# EAGLE design TiltMouseSurfaceMount (EAGLE 8.0.0)
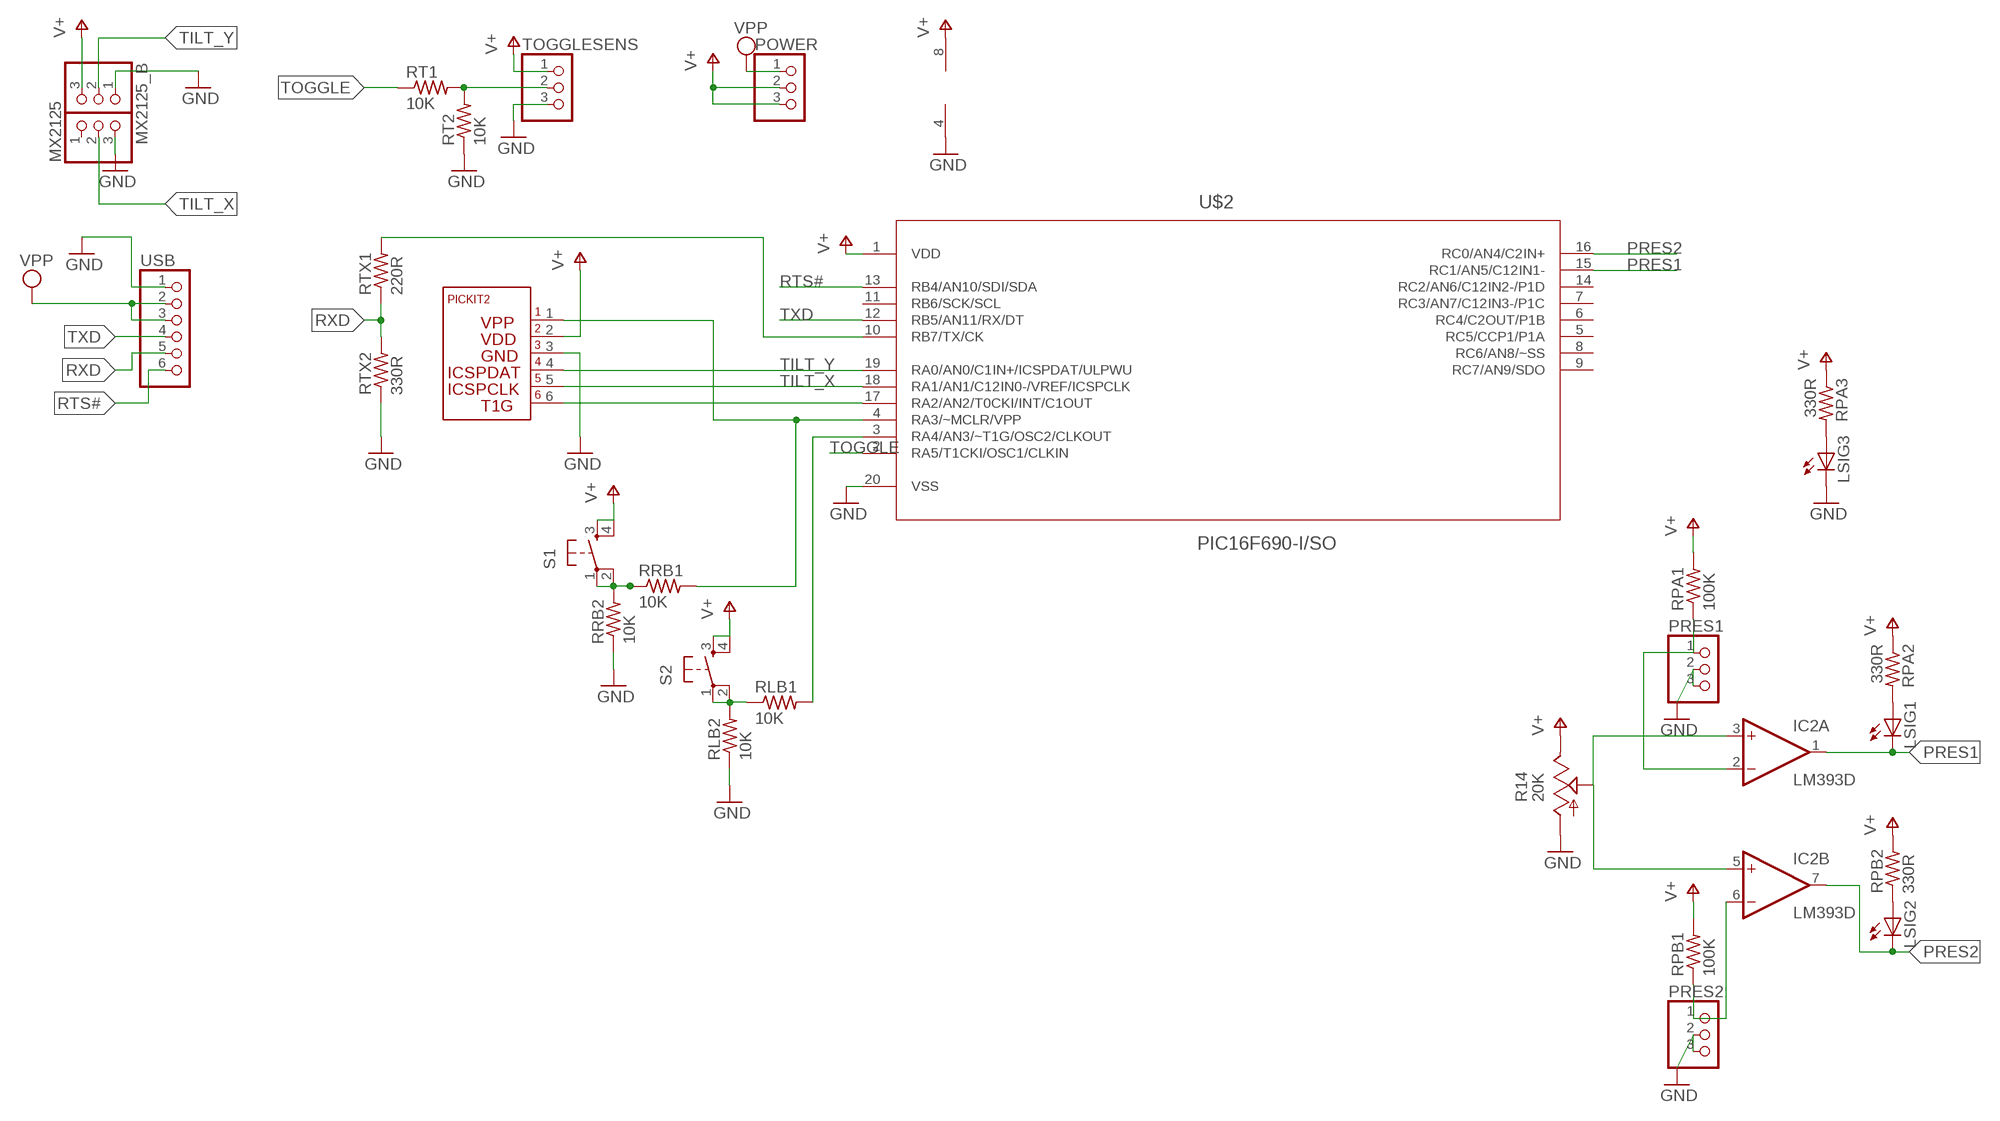
[diagram p0: schematic, sheet 1]

## Parts
IC2  LM393D  [SO08]
LSIG1  LEDSMT1206  [1206]
LSIG2  LEDSMT1206  [1206]
LSIG3  LEDSMT1206  [1206]
MX2125  PINHD-1X3  [1X03]
MX2125_B  PINHD-1X3  [1X03]
POWER  PINHD-1X3  [1X03]
PRES1  PINHD-1X3/90  [1X03/90]
PRES2  PINHD-1X3/90  [1X03/90]
R14  20K  TRIM_US-SM-42/43A  [SM-42/43A]
RLB1  10K  R-US_R0805  [R0805]
RLB2  10K  R-US_R0805  [R0805]
RPA1  100K  R-US_R0805  [R0805]
RPA2  330R  R-US_R0805  [R0805]
RPA3  330R  R-US_R0805  [R0805]
RPB1  100K  R-US_R0805  [R0805]
RPB2  330R  R-US_R0805  [R0805]
RRB1  10K  R-US_R0805  [R0805]
RRB2  10K  R-US_R0805  [R0805]
RT1  10K  R-US_R0805  [R0805]
RT2  10K  R-US_R0805  [R0805]
RTX1  220R  R-US_R0805  [R0805]
RTX2  330R  R-US_R0805  [R0805]
S1  TAC_SWITCHSMD  [TACTILE_SWITCH_SMD]
S2  TAC_SWITCHSMD  [TACTILE_SWITCH_SMD]
TOGGLESENS  PINHD-1X3  [1X03]
U$2  PIC16F690-I/SO  [SOIC127P1030X265-20N]
U$3  PICKIT-ICSP  [PICKITJUMPER]
USB  PINHD-1X6/90  [1X06/90]

## Nets
GND: IC2.4(P:V-) LSIG3.C MX2125.3 MX2125_B.1 PRES1.2 PRES1.3 PRES2.2 PRES2.3 R14.1(A) RLB2.1 RRB2.1 RT2.1 RTX2.1 TOGGLESENS.3 U$2.20(VSS) U$3.3 USB.1
N$2: RT1.2 RT2.2 TOGGLESENS.2
N$3: IC2.2(A:-IN) PRES1.1 RPA1.1
N$5: RTX1.2 U$2.10(RB7/TX/CK)
N$6: RRB1.1 RRB2.2 S1.1 S1.2
N$7: RLB1.1 RLB2.2 S2.1 S2.2
N$8: RLB1.2 U$2.3(RA4/AN3/~T1G/OSC2/CLKOUT)
N$9: IC2.6(B:-IN) PRES2.1 RPB1.1
N$10: IC2.3(A:+IN) IC2.5(B:+IN) R14.2(S)
N$11: LSIG2.A RPB2.1
N$12: LSIG1.A RPA2.2
N$13: LSIG3.A RPA3.2
N$14: RRB1.2 U$2.4(RA3/~MCLR/VPP) U$3.1
N$15: U$2.17(RA2/AN2/T0CKI/INT/C1OUT) U$3.6
PRES1: IC2.1(A:OUT) LSIG1.C U$2.15(RC1/AN5/C12IN1-)
PRES2: IC2.7(B:OUT) LSIG2.C U$2.16(RC0/AN4/C2IN+)
RTS#: U$2.13(RB4/AN10/SDI/SDA) USB.6
RXD: RTX1.1 RTX2.2 USB.5
TILT_X: MX2125.2 U$2.18(RA1/AN1/C12IN0-/VREF/ICSPCLK) U$3.5
TILT_Y: MX2125_B.2 U$2.19(RA0/AN0/C1IN+/ICSPDAT/ULPWU) U$3.4
TOGGLE: RT1.1 U$2.2(RA5/T1CKI/OSC1/CLKIN)
TXD: U$2.12(RB5/AN11/RX/DT) USB.4
V+: IC2.8(P:V+) MX2125_B.3 POWER.2 POWER.3 R14.3(E) RPA1.2 RPA2.1 RPA3.1 RPB1.2 RPB2.2 S1.3 S1.4 S2.3 S2.4 TOGGLESENS.1 U$2.1(VDD) U$3.2
VPP: POWER.1 USB.2 USB.3
Unconnected: MX2125.1 U$2.5(RC5/CCP1/P1A) U$2.6(RC4/C2OUT/P1B) U$2.7(RC3/AN7/C12IN3-/P1C) U$2.8(RC6/AN8/~SS) U$2.9(RC7/AN9/SDO) U$2.11(RB6/SCK/SCL) U$2.14(RC2/AN6/C12IN2-/P1D)

## Library data of the parts
IC2 = linear:LM393: COMPARATOR
LSIG1-LSIG3 = led:LED: LED OSRAM: - CHIPLED LG R971, LG N971, LY N971, LG Q971, LY Q971, LO R971, LY R971 LH N974, LH R974 LS Q976, LO Q976, LY Q976 LO Q996 - Hyper CHIPLED LW Q18S LB Q993, LB Q99A, LB R99A - SideLED LS A670, LO A670, LY A670, LG A670, LP A670 LB A673, LV A673, LT A673, LW A673 LH A674 LY A675 LS A676, LA A676, LO A676, LY A676, LW A676 LS A679, LY A679, LG A679 - Hyper Micro SIDELED® LS Y876, LA Y876, LO Y876, LY Y876 LT Y87S - SmartLED LW L88C, LW L88S LB L89C, LB L89S, LG L890 LS L89K, LO L89K, LY L89K LS L896, LA L896, LO L896, LY L896 - TOPLED LS T670, LO T670, LY T670, LG T670, LP T670 LSG T670, LSP T670, LSY T670, LOP T670, LYG T670 LG T671, LOG T671, LSG T671 LB T673, LV T673, LT T673, LW T673 LH T674 LS T676, LA T676, LO T676, LY T676, LB T676, LH T676, LSB T676, LW T676 LB T67C, LV T67C, LT T67C, LS T67K, LO T67K, LY T67K, LW E67C LS E67B, LA E67B, LO E67B, LY E67B, LB E67C, LV E67C, LT E67C LW T67C LS T679, LY T679, LG T679 LS T770, LO T770, LY T770, LG T770, LP T770 LB T773, LV T773, LT T773, LW T773 LH T774 LS E675, LA E675, LY E675, LS T675 LS T776, LA T776, LO T776, LY T776, LB T776 LHGB T686 LT T68C, LB T68C - Hyper Mini TOPLED® LB M676 - Mini TOPLED Santana® LG M470 LS M47K, LO M47K, LY M47K Source: http://www.osram.convergy.de LUXEON: - LUMILED® LXK2-PW12-R00, LXK2-PW12-S00, LXK2-PW14-U00, LXK2-PW14-V00 LXK2-PM12-R00, LXK2-PM12-S00, LXK2-PM14-U00 LXK2-PE12-Q00, LXK2-PE12-R00, LXK2-PE12-S00, LXK2-PE14-T00, LXK2-PE14-U00 LXK2-PB12-K00, LXK2-PB12-L00, LXK2-PB12-M00, LXK2-PB14-N00, LXK2-PB14-P00, LXK2-PB14-Q00 LXK2-PR12-L00, LXK2-PR12-M00, LXK2-PR14-Q00, LXK2-PR14-R00 LXK2-PD12-Q00, LXK2-PD12-R00, LXK2-PD12-S00 LXK2-PH12-R00, LXK2-PH12-S00 LXK2-PL12-P00, LXK2-PL12-Q00, LXK2-PL12-R00 Source: www.luxeon.com KINGBRIGHT: KA-3528ASYC Source: www.kingbright.com
MX2125 MX2125_B POWER PRES1 PRES2 TOGGLESENS = pinhead:PINHD-1X3: PIN HEADER
R14 = pot:TRIM_US-: POTENTIOMETER
RLB1 RLB2 RPA1-RPA3 RPB1 RPB2 RRB1 RRB2 RT1 RT2 RTX1 RTX2 = resistor:R-US_: RESISTOR, American symbol
S1 S2 = SparkFun:TAC_SWITCH: Momentary Switch Button commonly used for reset or general input. Spark Fun Electronics SKU : COM-00097
U$2 = Microchip_By_element14_Batch_1:PIC16F690-I/SO: 8-bit CMOS Microcontroller; DESCRIPTION: 8-bit CMOS Microcontroller; MPN: PIC16F690-I/SO; OC_FARNELL: 1292261; OC_NEWARK: 56J7549; PACKAGE: SOIC-18; SUPPLIER: Microchip Technology
U$3 = TEJ4M1:PICKIT-ICSP: The Jumper for connecting in a PICKIT 2
USB = pinhead:PINHD-1X6: PIN HEADER

## Board
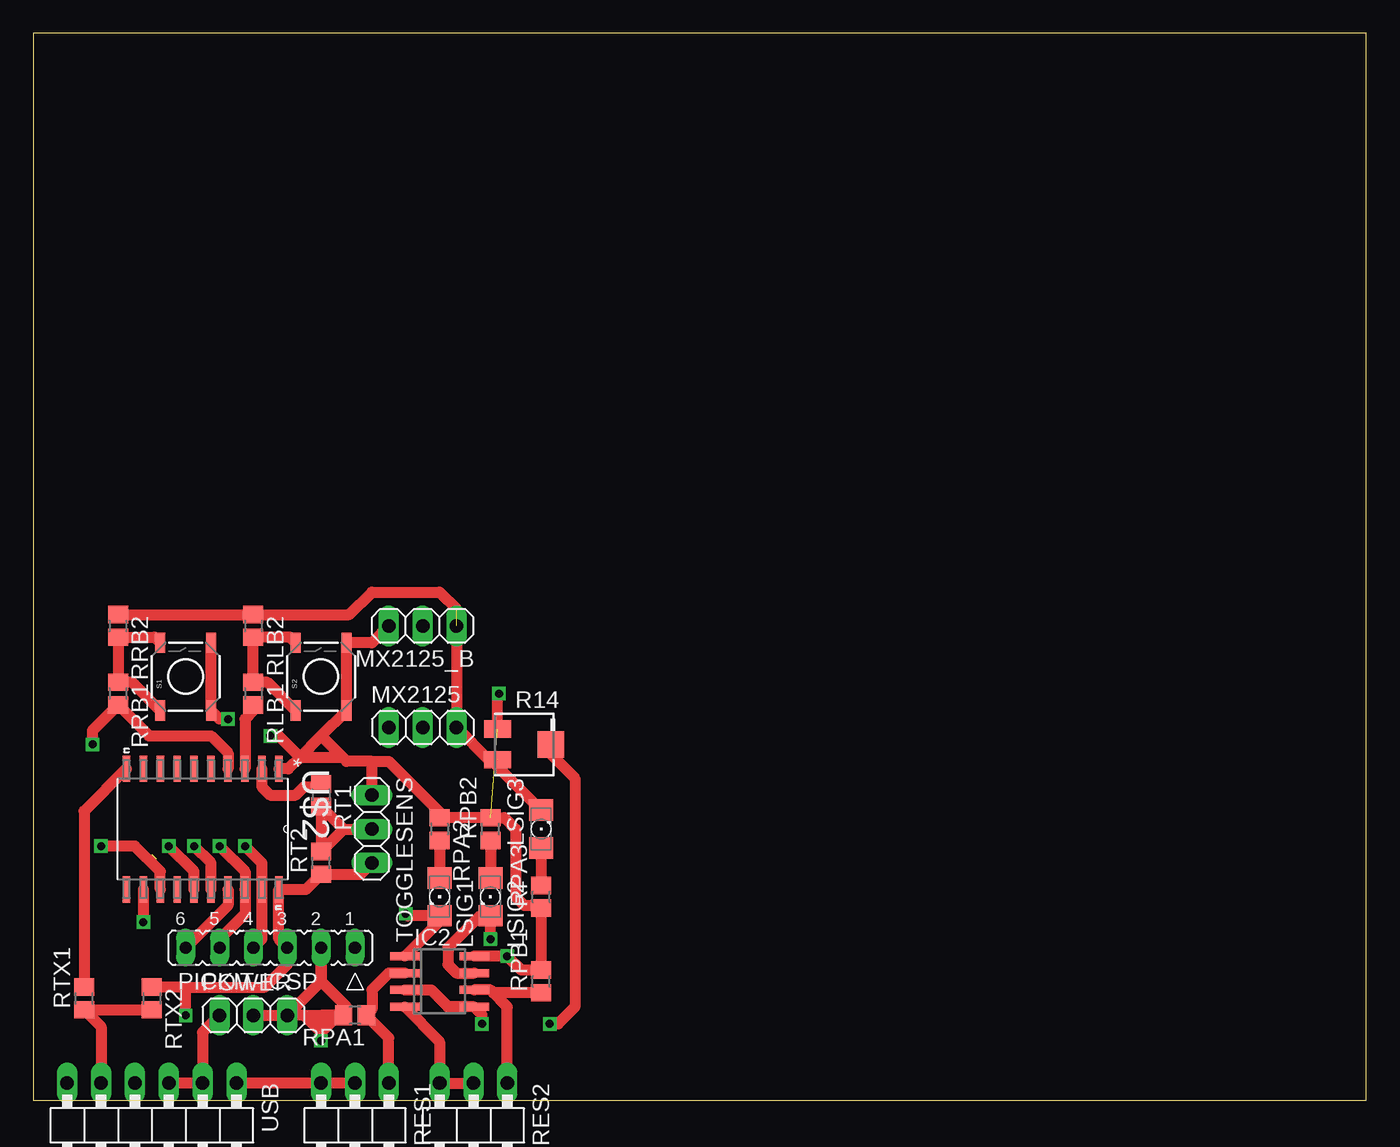
[diagram p1: board, top side]
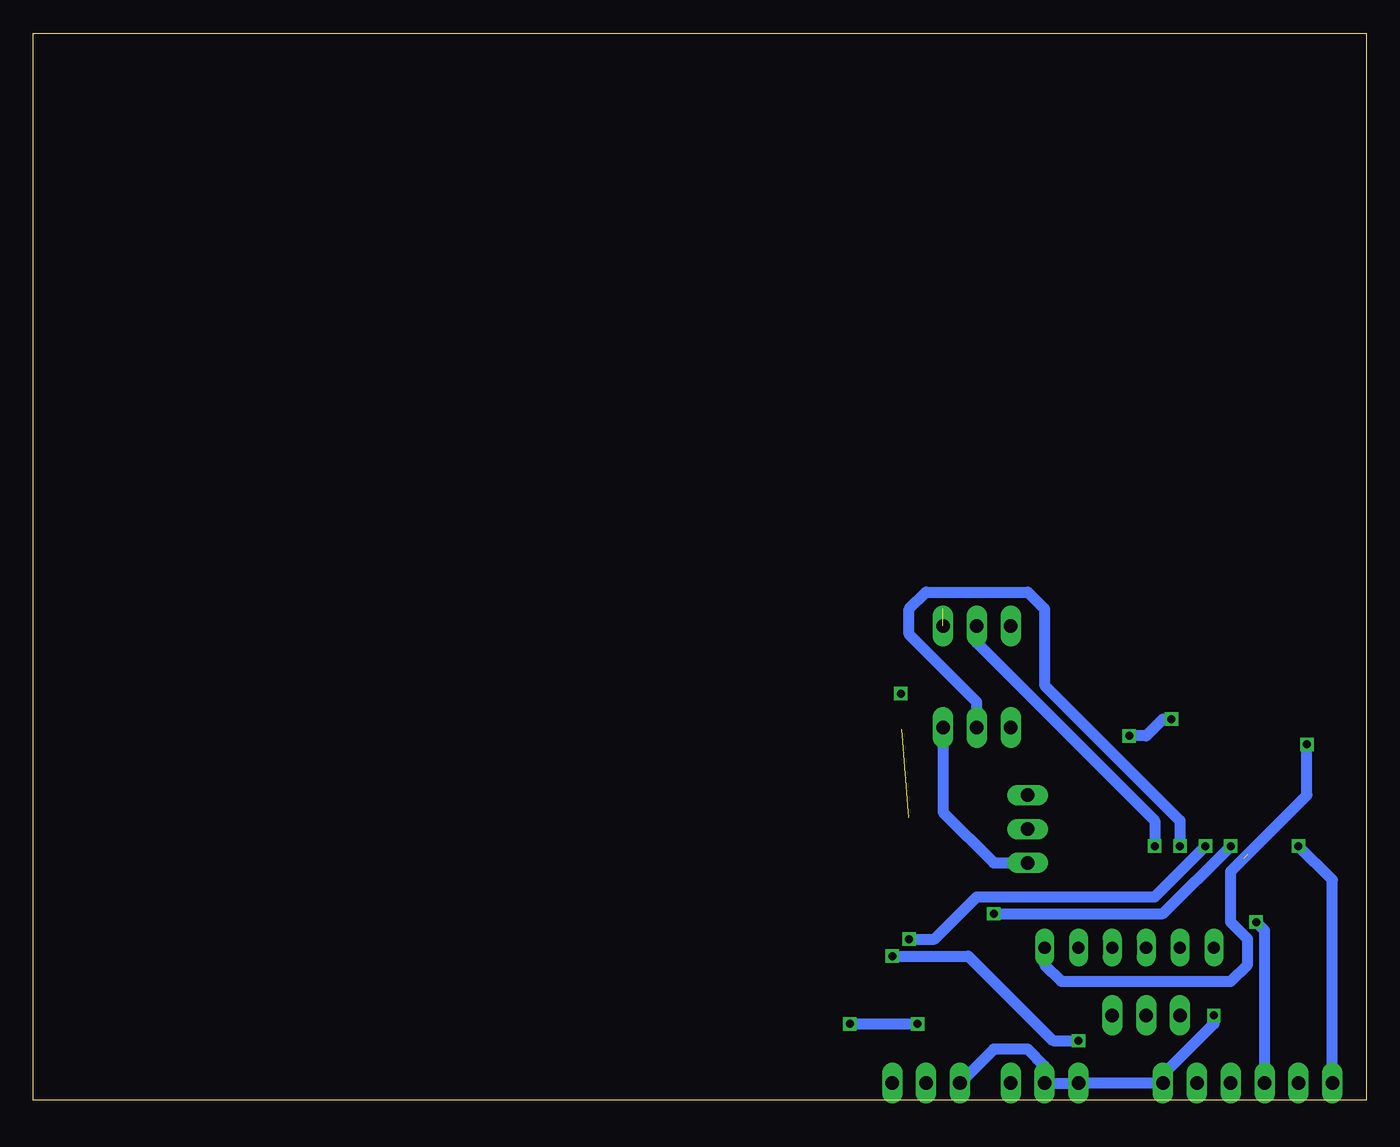
[diagram p2: board, bottom side, seen from below]

Size 100 x 80 mm. Coordinates in mm from the lower left corner, seen from the top.
Outline: 0,0 100,0 100,80 0,80 0,0
Copper layers (1*16): Top 0.035mm / dielectric 1.5mm / Bottom 0.035mm
Design rules "default": minimum track width 10mil, minimum drill 24mil, track to track 8mil, track to pad 8mil, pad to pad 8mil, via to via 8mil, smd to smd 8mil, copper to edge 40mil, drill to drill 8mil, minimum pad ring 10mil, minimum via ring 8mil, stop-mask expansion 4mil, vias tented up to drill 0mil, thermal gap 10mil

### Footprints (pad centres in the part's own frame; a part is rotated, then mirrored left to right if it is on the bottom)
SO08 = smd 0.6 x 2.2: 1 -1.905,-2.6; 2 -0.635,-2.6; 3 0.635,-2.6; 4 1.905,-2.6; 5 1.905,2.6; 6 0.635,2.6; 7 -0.635,2.6; 8 -1.905,2.6
1206 = smd 1.6 x 1.803: A -1.422,0; C 1.422,0
1X03 = drill 1.016 long: 1 -2.54,0; 2 0,0; 3 2.54,0
1X03/90 = drill 1.016 long: 1 -2.54,-3.81; 2 0,-3.81; 3 2.54,-3.81
SM-42/43A = smd 2 x 1.3: 1 2,1.15; 3 2,-1.15 | smd 2 x 2: 2 -2,0
R0805 = smd 1.3 x 1.5: 1 -0.85,0; 2 0.85,0
TACTILE_SWITCH_SMD = smd 1.524 x 0.762: 1 -2.54,1.905; 2 2.54,1.905; 3 -2.54,-1.905; 4 2.54,-1.905
SOIC127P1030X265-20N = smd 1.981 x 0.559: 1 -4.521,5.715; 2 -4.521,4.445; 3 -4.521,3.175; 4 -4.521,1.905; 5 -4.521,0.635; 6 -4.521,-0.635; 7 -4.521,-1.905; 8 -4.521,-3.175; 9 -4.521,-4.445; 10 -4.521,-5.715; 11 4.521,-5.715; 12 4.521,-4.445; 13 4.521,-3.175; 14 4.521,-1.905; 15 4.521,-0.635; 16 4.521,0.635; 17 4.521,1.905; 18 4.521,3.175; 19 4.521,4.445; 20 4.521,5.715
PICKITJUMPER = drill 0.914 long: 1 6.35,3.81; 2 3.81,3.81; 3 1.27,3.81; 4 -1.27,3.81; 5 -3.81,3.81; 6 -6.35,3.81
1X06/90 = drill 1.016 long: 1 -6.35,-3.81; 2 -3.81,-3.81; 3 -1.27,-3.81; 4 1.27,-3.81; 5 3.81,-3.81; 6 6.35,-3.81

### Placement (x,y rotation side)
IC2  30.48,8.89 270 top
LSIG1  30.48,15.24 270 top
LSIG2  34.29,15.24 270 top
LSIG3  38.1,20.32 90 top
MX2125  29.21,27.94 0 top
MX2125_B  29.21,35.56 180 top
POWER  16.51,6.35 0 top
PRES1  24.13,-2.54 180 top
PRES2  33.02,-2.54 180 top
R14  36.83,26.67 180 top
RLB1  16.51,30.48 270 top
RLB2  16.51,35.56 270 top
RPA1  24.13,6.35 180 top
RPA2  30.48,20.32 270 top
RPA3  38.1,15.24 90 top
RPB1  38.1,8.89 90 top
RPB2  34.29,20.32 90 top
RRB1  6.35,30.48 270 top
RRB2  6.35,35.56 270 top
RT1  21.59,22.86 270 top
RT2  21.59,17.78 90 top
RTX1  3.81,7.62 90 top
RTX2  8.89,7.62 270 top
S1  11.43,31.75 90 top
S2  21.59,31.75 90 top
TOGGLESENS  25.4,20.32 270 top
U$2  12.7,20.32 270 top
U$3  17.78,7.62 0 top
USB  8.89,-2.54 180 top

### Tracks (layer width: path | path; a pad name or v marks a point on that pad's centre or on a via)
GND  (via drill 0.6)  (2 unrouted)
  Top 0.813: RRB2.1 RLB2.1 23.71,36.41 25.4,38.1 30.48,38.1 31.75,36.83 | 11.43,8.47 17.36,8.47 19.05,10.16 U$3.3 18.41,12.06 U$2.20 20.46,15.8 21.38,16.72 | 11.43,8.47 RTX2.1 | v11.43,6.35 11.43,8.47 | PRES1.2 PRES1.3 USB.1 | IC2.4 30.48,4.38 PRES2.3 PRES2.2 | 21.38,16.72 RT2.1 | RT2.1 24.55,16.93 TOGGLESENS.3 | RT2.1 21.38,16.72 | RT2.1 21.38,16.72 | RT2.1 21.38,16.72 | LSIG3.C 34.83,25.01 R14.1 34.17,25.52 MX2125.3 MX2125_B.1
  Bottom 0.813: v11.43,6.35 11.43,5.71 15.24,1.91 USB.1 PRES1.3 PRES1.2 24.13,2.54 25.4,3.81 27.94,3.81 PRES2.3 | MX2125.3 31.75,21.59 27.94,17.78 TOGGLESENS.3
N$2
  Top 0.813: 23.28,20.32 TOGGLESENS.2 | 23.28,20.32 RT1.2 RT2.2 23.28,20.32
N$3
  Top 0.813: PRES1.1 26.67,4.66 RPA1.1 25.4,6.77 25.4,8.26 26.67,9.53 IC2.2
N$5
  Top 0.813: U$2.10 3.81,21.67 RTX1.2
N$6
  Top 0.813: S1.2 9.11,34.71 RRB2.2 RRB1.1 7.41,31.33 S1.1
N$7
  Top 0.813: S2.2 19.27,34.71 RLB2.2 RLB1.1 17.57,31.33 S2.1
N$8
  Top 0.813: RLB1.2 16.51,29.21 15.88,28.57 U$2.3
N$9
  Top 0.813: PRES2.1 35.56,6.99 34.29,8.26 | 34.29,8.26 IC2.6 | RPB1.1 34.51,8.04 34.29,8.26
N$10  (via drill 0.6)
  Top 0.813: IC2.3 29.84,8.26 31.11,6.99 IC2.5 33.66,6.41 v33.66,5.71 | 38.83,25.94 R14.2 38.83,25.94 | 38.83,25.94 40.64,24.13 40.64,6.99 39.37,5.71 v38.73,5.71
  Bottom 0.813: v38.73,5.71 v33.66,5.71
N$11
  Top 0.813: RPB2.1 LSIG2.A
N$12
  Top 0.813: RPA2.2 LSIG1.A
N$13
  Top 0.813: LSIG3.A RPA3.2
N$14  (via drill 0.6)  (1 unrouted)
  Top 0.813: U$2.4 14.61,26.04 13.34,27.3 8.68,27.3 RRB1.2 4.45,27.73 v4.45,26.67
  Bottom 0.813: U$3.1 24.13,10.16 22.86,8.89 11.43,8.89 10.16,8.89 8.89,10.16 8.89,12.06 10.16,13.34 10.16,17.14 8.89,18.41 | 9.21,18.1 4.45,22.86 v4.45,26.67
N$15
  Top 0.813: U$2.17 14.61,14.61 U$3.6
PRES1  (via drill 0.6)
  Top 0.813: IC2.1 30.48,13.39 LSIG1.C 28.09,13.82 v27.94,13.97 | U$2.15 12.06,17.14 v10.16,19.05
  Bottom 0.813: v27.94,13.97 15.24,13.97 v10.16,19.05
PRES2  (via drill 0.6)
  Top 0.813: IC2.7 31.75,9.53 31.11,10.16 31.11,11.43 33.5,13.82 LSIG2.C v34.29,12.06 | U$2.16 13.34,17.78 v12.06,19.05
  Bottom 0.813: v34.29,12.06 32.38,12.06 29.21,15.24 15.88,15.24 v12.06,19.05
RTS#  (via drill 0.6)
  Top 0.813: U$2.13 9.53,17.14 7.62,19.05 v5.08,19.05
  Bottom 0.813: v5.08,19.05 2.54,16.51 USB.6
RXD
  Top 0.813: USB.5 5.08,5.5 RTX1.1 RTX2.2
TILT_X  (via drill 0.6)
  Top 0.813: U$3.5 13.97,12.06 15.88,13.97 U$2.18 15.88,17.14 v13.97,19.05
  Bottom 0.813: MX2125.2 29.21,29.84 34.29,34.92 34.29,36.83 33.02,38.1 25.4,38.1 24.13,36.83 24.13,31.11 13.97,20.95 v13.97,19.05
TILT_Y  (via drill 0.6)
  Top 0.813: U$3.4 17.14,12.06 U$2.19 17.14,17.78 v15.88,19.05
  Bottom 0.813: MX2125_B.2 29.21,34.29 15.88,20.95 v15.88,19.05
TOGGLE
  Top 0.813: U$2.2 17.14,23.5 17.78,22.86 19.68,22.86 20.32,23.5 21.38,23.5 RT1.1
TXD  (via drill 0.6)
  Top 0.813: U$2.12 v8.26,13.34
  Bottom 0.813: USB.4 7.62,12.7 v8.26,13.34
V+  (via drill 0.6)  (2 unrouted)
  Top 0.813: S1.4 S1.3 13.97,28.57 v14.61,28.57 | MX2125_B.3 25.4,34.29 S2.4 S2.3 21.59,27.3 | POWER.2 POWER.3 | POWER.3 21.59,8.89 | 21.59,8.89 U$3.2 21.59,8.89 | 22.86,6.35 21.59,6.35 | 20.32,6.35 21.59,6.35 | 20.32,6.35 POWER.3 | RPA1.2 22.86,6.35 | RPA1.2 22.86,6.35 | RPA1.2 22.86,6.35 | RPA1.2 22.86,6.35 | RPA1.2 22.86,6.35 | RPA1.2 22.86,6.35 | RPA1.2 22.86,6.35 | RPA1.2 22.86,6.35 | RPA1.2 22.86,6.35 | RPA1.2 22.86,6.35 | RPA1.2 22.86,6.35 | RPA1.2 22.86,6.35 | IC2.8 v35.56,10.79 36.62,9.74 RPB1.2 RPA3.1 37.88,14.61 36.83,14.61 36.2,15.24 36.2,20.32 35.34,21.17 RPB2.2 RPA2.1 30.48,21.59 26.67,25.4 25.4,25.4 | U$2.1 19.13,24.84 20,25.72 | 20,25.72 21.59,27.3 | 25.4,25.4 23.5,25.4 | 23.5,25.4 21.59,27.3 | 20,25.72 23.18,25.72 23.5,25.4 | TOGGLESENS.1 25.4,25.4 | v17.78,27.3 18.41,27.3 20,25.72 | 21.59,6.35 v21.59,4.45 | v21.59,4.45 21.59,5.08 | 21.59,5.08 22.86,6.35 | v21.59,4.45 21.59,5.08 | 21.59,5.08 20.32,6.35 | RPA1.2 23.5,6.57 23.5,6.99 21.59,8.89 | R14.3 34.83,30.39 v34.92,30.48
  Bottom 0.813: v14.61,28.57 15.24,28.57 16.51,27.3 v17.78,27.3 | v35.56,10.79 29.84,10.79 23.5,4.45 v21.59,4.45
VPP
  Top 0.813: USB.3 USB.2 12.7,5.08 POWER.1